# EAGLE schematic qo-100-pa-driver (EAGLE 9.6.2)
CREVISION: 1; DESIGNER: Joao Silva
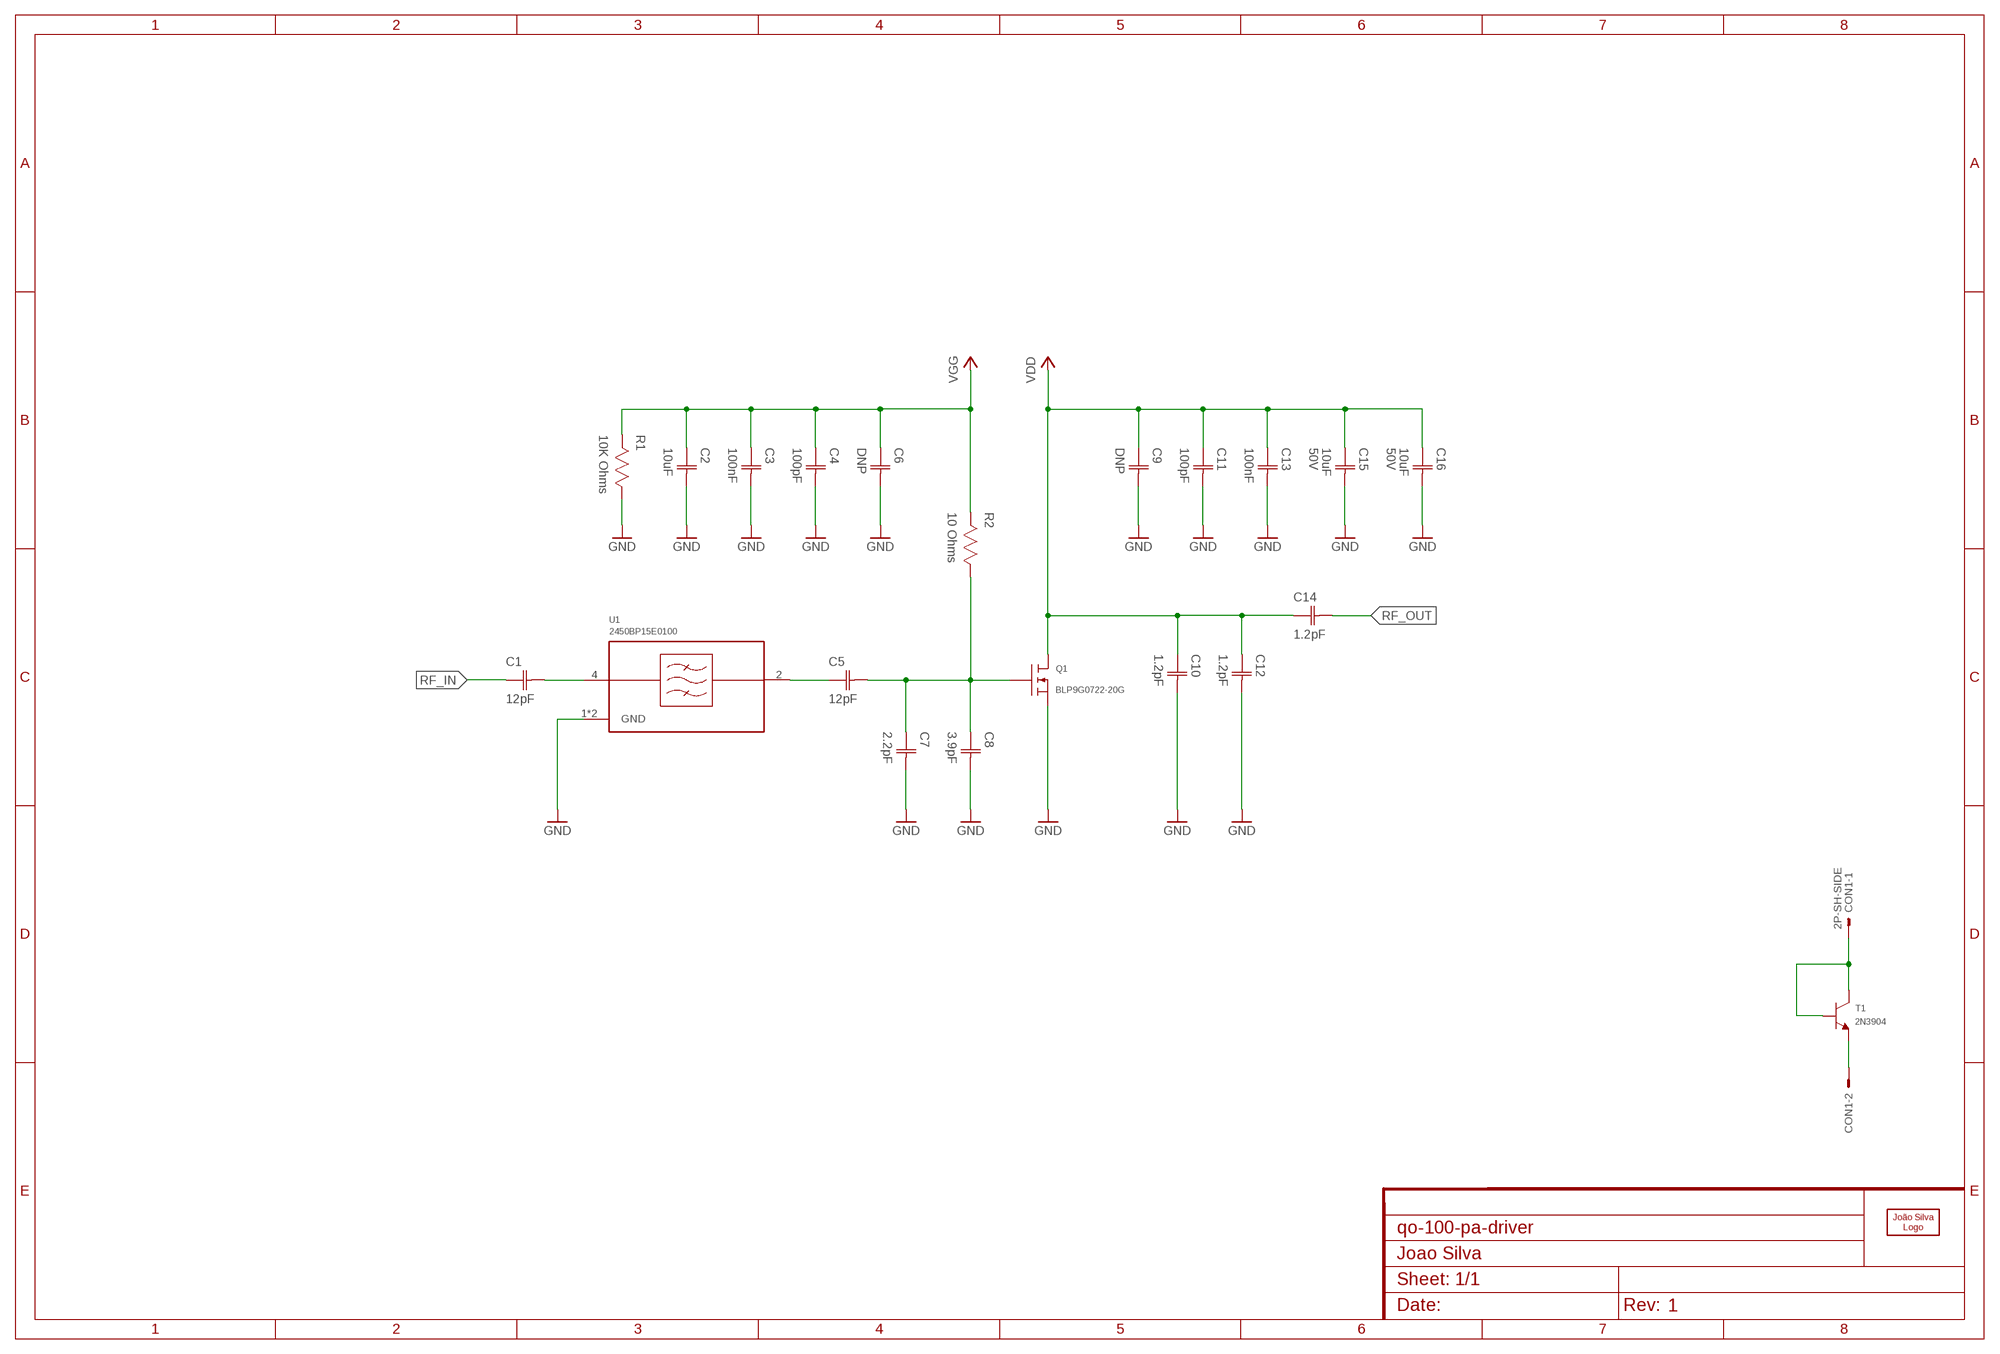
[diagram p0: schematic, sheet 1]

## Parts
C1  12pF  CAPACITOR-0603  [CAP0603]
C2  10uF  CAPACITOR-0603  [CAP0603]
C3  100nF  CAPACITOR-0603  [CAP0603]
C4  100pF  CAPACITOR-0603  [CAP0603]
C5  12pF  CAPACITOR-0603  [CAP0603]
C6  DNP  CAPACITOR-0603  [CAP0603]
C7  2.2pF  CAPACITOR-0603  [CAP0603]
C8  3.9pF  CAPACITOR-0603  [CAP0603]
C9  DNP  CAPACITOR-0603  [CAP0603]
C10  1.2pF  CAPACITOR-0603  [CAP0603]
C11  100pF  CAPACITOR-0603  [CAP0603]
C12  1.2pF  CAPACITOR-0603  [CAP0603]
C13  100nF  CAPACITOR-0603  [CAP0603]
C14  1.2pF  CAPACITOR-0603  [CAP0603]
C15  10uF  CAPACITOR-1206  [CAP1206]
C16  10uF  CAPACITOR-1206  [CAP1206]
CON1  2P-SH-SIDE  [SH-02-SIDE]
LOGO1  JS-5MM  [JS_5MM]
Q1  BLP9G0722-20G  [SOT1483-1]
R1  10K Ohms  RESISTOR-0603  [RES0603]
R2  10 Ohms  RESISTOR-0603  [RES0603]
T1  2N3904  [SOT23]
U1  2450BP15E0100  [2450BP15E0100]

## Nets
GND: C2.2(C2) C3.2(C2) C4.2(C2) C6.2(C2) C7.2(C2) C8.2(C2) C9.2(C2) C10.2(C2) C11.2(C2) C12.2(C2) C13.2(C2) C15.2(C2) C16.2(C2) Q1.3@0(S) Q1.3@1(S) Q1.3@2(S) R1.1 U1.1(GND) U1.3(GND)
N$1: CON1.2 T1.2(E)
N$2: C5.2(C2) C7.1(C1) C8.1(C1) Q1.2(G) R2.1
N$3: CON1.1 T1.1(B) T1.3(C)
N$5: C5.1(C1) U1.2(RFOUT)
N$6: C1.2(C2) U1.4(RFIN)
RF_IN: C1.1(C1)
RF_OUT: C14.2(C2)
VDD: C9.1(C1) C10.1(C1) C11.1(C1) C12.1(C1) C13.1(C1) C14.1(C1) C15.1(C1) C16.1(C1) Q1.1(D)
VGG: C2.1(C1) C3.1(C1) C4.1(C1) C6.1(C1) R1.2 R2.2

## Library data of the parts
C1-C14 = Capacitor:CAPACITOR
C15 C16 = Capacitor:CAPACITOR; VOLTAGE: 50V
CON1 = JST:2P: Disconnectable Crimp style connector, 1.0mm pitch 2 contacts
LOGO1 = Silkscreen:JS
Q1 = Ampleon:BLP9G0722-20
R1 R2 = Resistor:RESISTOR
T1 = Generic BJT:2N3904
U1 = Generic Filter:2450BP15E0100